# EAGLE design A4a ESP32-WROOM-32 (EAGLE 9.6.2)
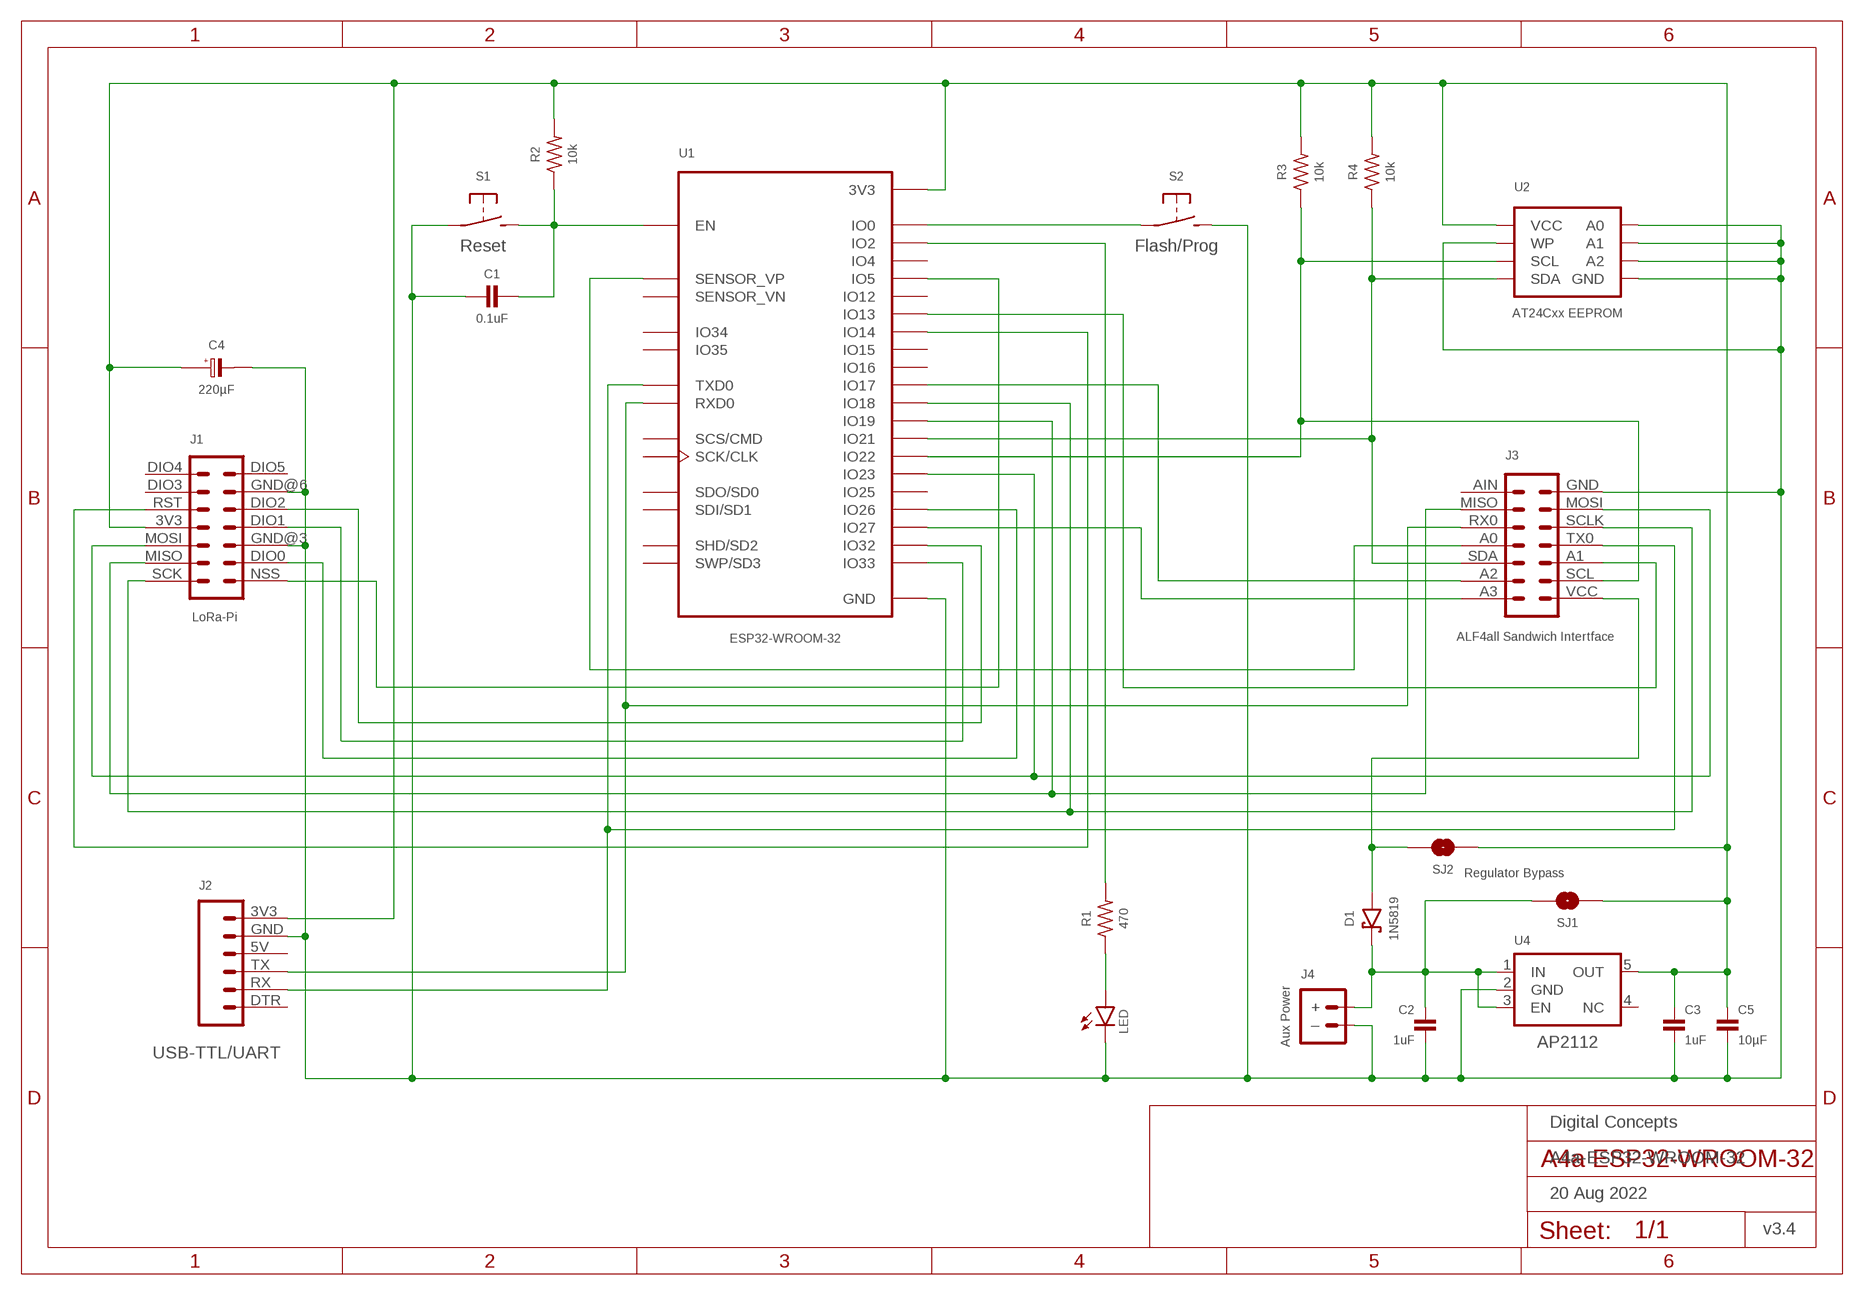
[diagram p0: schematic, sheet 1]
FRAME1 (A4L-LOC): DATE: 20 Aug 2022; OWNER: Digital Concepts; TITLE: A4a-ESP32-WROOM-32; VERSION: v3.4

## Parts
C1  0.1uF  CAPACITOR  [C0805@1]
C2  1uF  CAPACITOR-0805  [C0805]
C3  1uF  CAPACITOR-0805  [C0805]
C4  220µF  CAPACITOR-TANTALUM-3528  [C3528-21]
C5  10µF  CAPACITOR-0805  [C0805]
D1  1N5819  DIODE-SCHOTTKY-1N5819  [SOD-123]
J1  LoRa-Pi  RFM95W-PI-HEADER  [RFM95W-PI]
J2  USB-TTL/UART  HEADER-1X6-UART  [CONN_06-UART]
J3  ALF4all Sandwich Intertface  HEADER-2X7-ALF4ALL-PROCESSOR-B  [CONN_2X7-ALF4ALL-PROCESSOR-B]
J4  Aux Power  JST-PH2.0-2-MALE-HORIZONTALJST-PTH-2  [JST-PH2.0-2-HORIZONTAL]
LED  LEDCHIP-LED0805  [CHIP-LED0805]
R1  470  RESISTORR0805  [R0805]
R2  10k  RESISTORR0805  [R0805]
R3  10k  RESISTORR0805  [R0805]
R4  10k  RESISTORR0805  [R0805]
S1  Reset  SWITCH-MOMENTARY-2-PIN  [SWITCH-2-PAD]
S2  Flash/Prog  SWITCH-MOMENTARY-2-PIN  [SWITCH-2-PAD]
SJ1  Regulator Bypass  SJ  [SJ]
SJ2  SJ  [SJ]
U1  ESP32-WROOM-32  [ESP32-WROOM-32]
U2  AT24Cxx EEPROM  AT24CXX-EEPROM  [SOP-8]
U4  AP2112  REGULATOR-AP2112  [SOT25]

## Nets
GND: C1.2 C2.2 C3.2 C4.2(-) C5.2 J1.GND@3 J1.GND@6 J2.GND J3.GND J4.-(–) LED.C S1.P$1(P) S2.P$2(S) U1.GND@1(GND) U1.GND@15(GND) U1.GND@38(GND) U1.TP(GND) U1.TP@P1(GND) U1.TP@P2(GND) U1.TP@P3(GND) U1.TP@P4(GND) U1.TP@P5(GND) U1.TP@P6(GND) U1.TP@P7(GND) U1.TP@P8(GND) U1.TP@P9(GND) U1.TP@V1(GND) U1.TP@V2(GND) U1.TP@V3(GND) U1.TP@V4(GND) U1.TP@V5(GND) U1.TP@V6(GND) U1.TP@V7(GND) U1.TP@V8(GND) U1.TP@V9(GND) U1.TP@V10(GND) U1.TP@V11(GND) U1.TP@V12(GND) U1.TP@VP5(GND) U2.P$1(A0) U2.P$2(A1) U2.P$3(A2) U2.P$4(GND) U2.P$7(WP) U4.2(GND)
N$1: J1.DIO2 U1.IO32
N$2: J1.NSS U1.IO5
N$3: J1.SCK J3.SCLK U1.IO18
N$4: J1.RST U1.IO14
N$5: J1.MISO J3.MISO U1.IO19
N$6: J1.MOSI J3.MOSI U1.IO23
N$7: LED.A R1.1
N$8: S2.P$1(P) U1.IO0
N$9: J3.A2 U1.IO17
N$10: C2.1 D1.C J4.+ SJ1.1 U4.1(IN) U4.3(EN)
N$11: D1.A J3.VCC SJ2.1
N$12: J3.SCL R3.1 U1.IO22 U2.P$6(SCL)
N$13: C1.1 R2.1 S1.P$2(S) U1.EN
N$14: J3.SDA R4.1 U1.IO21 U2.P$5(SDA)
N$15: J3.A1 U1.IO13
N$16: J2.TX J3.RX0 U1.RXD0
N$17: R1.2 U1.IO2
N$18: J1.DIO0 U1.IO26
N$21: J3.A0 U1.SENSOR_VP
N$22: J3.A3 U1.IO27
N$26: J1.DIO1 U1.IO33
VC: J2.RX J3.TX0 U1.TXD0
VCC: C3.1 C4.1(+) C5.1 J1.3V3 J2.3V3 R2.2 R3.2 R4.2 SJ1.2 SJ2.2 U1.3V3 U2.P$8(VCC) U4.5(OUT)
Unconnected: J1.DIO3 J1.DIO4 J1.DIO5 J2.5V J2.DTR J3.AIN U1.CLK(SCK/CLK) U1.CMD(SCS/CMD) U1.IO4 U1.IO12 U1.IO15 U1.IO16 U1.IO25 U1.IO34 U1.IO35 U1.SD0(SDO/SD0) U1.SD1(SDI/SD1) U1.SD2(SHD/SD2) U1.SD3(SWP/SD3) U1.SENSOR_VN U4.4(NC)

## Library data of the parts
C1 = digitalconcepts:CAPACITOR: 0805 Capacitor
C2 C3 C5 = digitalconcepts:CAPACITOR-0805: 0805 Capacitor
C4 = digitalconcepts:CAPACITOR-TANTALUM-3528: Capacitor Polarised EIA 3528-21 (KEMET B)
D1 = digitalconcepts:DIODE-SCHOTTKY-1N5819: 1N5819 Schottky Diode SOD-123
J1 = digitalconcepts:RFM95W-PI-HEADER: RFM95W LoRa Wireless Transceiver Raspberry Pi Daughter Board
J2 = digitalconcepts:HEADER-1X6-UART: UART 6-Pin Header
J3 = digitalconcepts:HEADER-2X7-ALF4ALL-PROCESSOR-B: ALF4all 'Sandwich' Processor (Bottom) 2x7 Pin Header Header soldered to underside of PCB
J4 = digitalconcepts:JST-PH2.0-2-MALE-HORIZONTAL: PH2.0 2P Right Angle PCB Connector; PROD_ID: CONN-09863; SKU: PRT-09914
LED = digitalconcepts:LED: LED OSRAM: - CHIPLED LG R971, LG N971, LY N971, LG Q971, LY Q971, LO R971, LY R971 LH N974, LH R974 LS Q976, LO Q976, LY Q976 LO Q996 - Hyper CHIPLED LW Q18S LB Q993, LB Q99A, LB R99A - SideLED LS A670, LO A670, LY A670, LG A670, LP A670 LB A673, LV A673, LT A673, LW A673 LH A674 LY A675 LS A676, LA A676, LO A676, LY A676, LW A676 LS A679, LY A679, LG A679 - Hyper Micro SIDELED® LS Y876, LA Y876, LO Y876, LY Y876 LT Y87S - SmartLED LW L88C, LW L88S LB L89C, LB L89S, LG L890 LS L89K, LO L89K, LY L89K LS L896, LA L896, LO L896, LY L896 - TOPLED LS T670, LO T670, LY T670, LG T670, LP T670 LSG T670, LSP T670, LSY T670, LOP T670, LYG T670 LG T671, LOG T671, LSG T671 LB T673, LV T673, LT T673, LW T673 LH T674 LS T676, LA T676, LO T676, LY T676, LB T676, LH T676, LSB T676, LW T676 LB T67C, LV T67C, LT T67C, LS T67K, LO T67K, LY T67K, LW E67C LS E67B, LA E67B, LO E67B, LY E67B, LB E67C, LV E67C, LT E67C LW T67C LS T679, LY T679, LG T679 LS T770, LO T770, LY T770, LG T770, LP T770 LB T773, LV T773, LT T773, LW T773 LH T774 LS E675, LA E675, LY E675, LS T675 LS T776, LA T776, LO T776, LY T776, LB T776 LHGB T686 LT T68C, LB T68C - Hyper Mini TOPLED® LB M676 - Mini TOPLED Santana® LG M470 LS M47K, LO M47K, LY M47K Source: http://www.osram.convergy.de LUXEON: - LUMILED® LXK2-PW12-R00, LXK2-PW12-S00, LXK2-PW14-U00, LXK2-PW14-V00 LXK2-PM12-R00, LXK2-PM12-S00, LXK2-PM14-U00 LXK2-PE12-Q00, LXK2-PE12-R00, LXK2-PE12-S00, LXK2-PE14-T00, LXK2-PE14-U00 LXK2-PB12-K00, LXK2-PB12-L00, LXK2-PB12-M00, LXK2-PB14-N00, LXK2-PB14-P00, LXK2-PB14-Q00 LXK2-PR12-L00, LXK2-PR12-M00, LXK2-PR14-Q00, LXK2-PR14-R00 LXK2-PD12-Q00, LXK2-PD12-R00, LXK2-PD12-S00 LXK2-PH12-R00, LXK2-PH12-S00 LXK2-PL12-P00, LXK2-PL12-Q00, LXK2-PL12-R00 Source: www.luxeon.com KINGBRIGHT: KA-3528ASYC Source: www.kingbright.com
R1-R4 = digitalconcepts:RESISTOR: Resistor; SPICEPREFIX: R
S1 S2 = digitalconcepts:SWITCH-MOMENTARY-2-PIN: 2 Pin Momentary Switch
SJ1 SJ2 = digitalconcepts:SJ: Solder Jumper
U1 = digitalconcepts:ESP32-WROOM-32: ESP32-WROOM-32 MCU
U2 = digitalconcepts:AT24CXX-EEPROM: AT24Cxx EEPROM SOP-8
U4 = digitalconcepts:REGULATOR-AP2112: Diodes Incorporated LDO Regulator with Enable; OC_FARNELL: unknown; OC_NEWARK: unknown

## Board
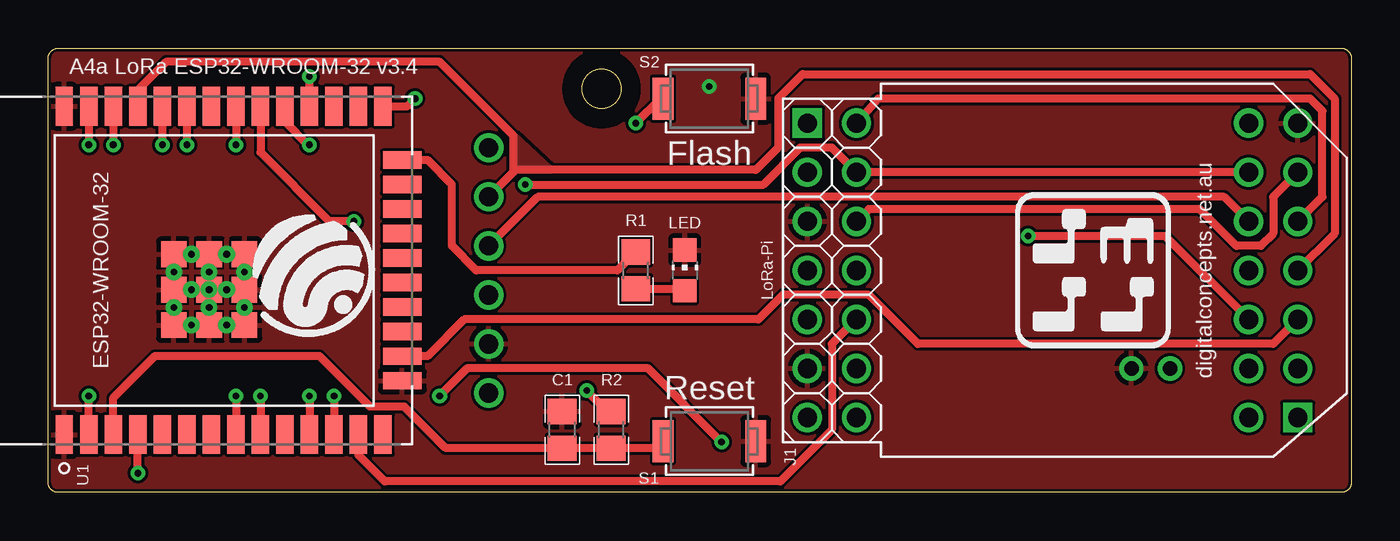
[diagram p1: board, top side]
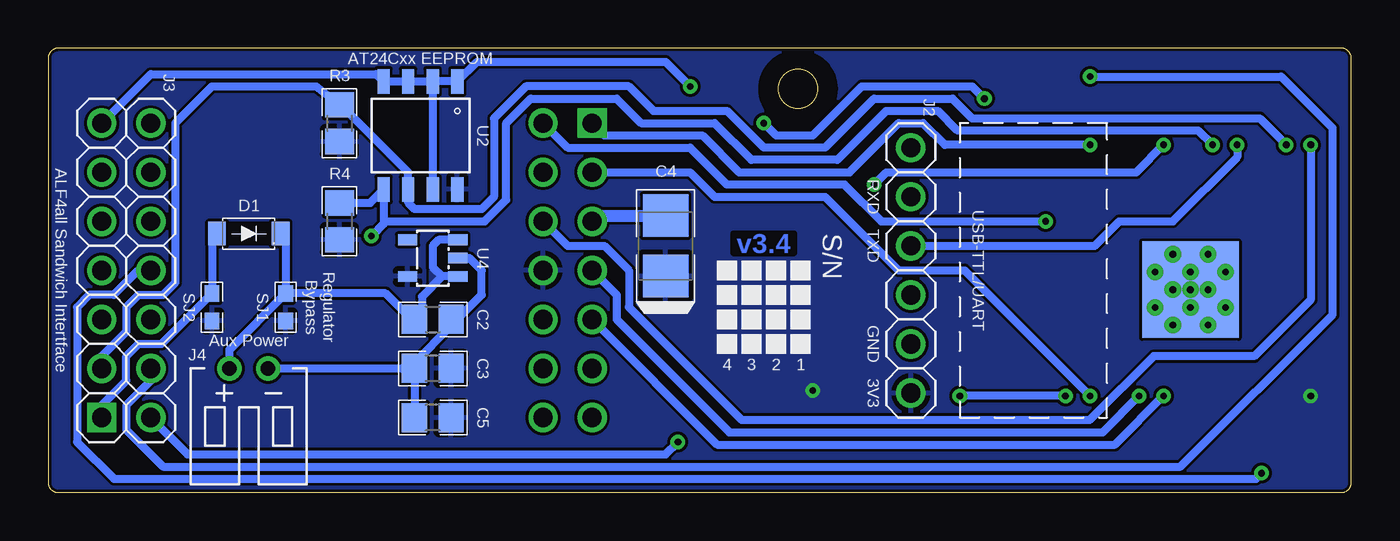
[diagram p2: board, bottom side, seen from below]

Size 67.49 x 23 mm. Coordinates in mm from the lower left corner, seen from the top.
Outline: 67.02,23 67.06,23 67.09,22.99 67.12,22.98 67.15,22.97 67.18,22.96 67.21,22.95 67.24,22.93 67.27,22.91 67.29,22.9 67.32,22.88 67.34,22.85 67.36,22.83 67.38,22.81 67.4,22.78 67.42,22.75 67.44,22.72 67.45,22.69 67.46,22.66 67.47,22.63 67.48,22.6 67.48,22.57 67.49,22.53 67.49,0.47 67.48,0.43 67.48,0.4 67.47,0.37 67.46,0.34 67.45,0.31 67.44,0.28 67.42,0.25 67.4,0.22 67.38,0.19 67.36,0.17 67.32,0.12 67.29,0.1 67.27,0.09 67.24,0.07 67.21,0.05 67.18,0.04 67.15,0.03 67.12,0.02 67.09,0.01 67.06,0 67.02,0 0.47,0 0.43,0 0.4,0.01 0.37,0.02 0.34,0.03 0.28,0.05 0.25,0.07 0.22,0.09 0.19,0.1 0.17,0.12 0.12,0.17 0.1,0.19 0.09,0.22 0.07,0.25 0.05,0.28 0.04,0.31 0.03,0.34 0.02,0.37 0.01,0.4 0,0.43 0,0.47 0,22.53 0,22.57 0.01,22.6 0.02,22.63 0.03,22.66 0.04,22.69 0.05,22.72 0.07,22.75 0.09,22.78 0.1,22.81 0.12,22.83 0.15,22.85 0.17,22.88 0.19,22.9 0.22,22.91 0.25,22.93 0.28,22.95 0.34,22.97 0.37,22.98 0.4,22.99 0.43,23 0.47,23 67.02,23
Outline: circle at 28.65,20.9 radius 1.02
Copper layers (1*16): Top 0.035mm / dielectric 1.5mm / Bottom 0.035mm
Design rules "default *": minimum track width 6mil, minimum drill 0.35mm, track to track 6mil, track to pad 6mil, pad to pad 6mil, via to via 6mil, smd to smd 6mil, copper to edge 6mil, drill to drill 6mil, minimum pad ring 10mil, minimum via ring 8mil, stop-mask expansion 4mil, vias tented up to drill 0mil, thermal gap 10mil

### Footprints (pad centres in the part's own frame; a part is rotated, then mirrored left to right if it is on the bottom)
C0805@1 = smd 1.3 x 1.5: 1 -0.95,0; 2 0.95,0
C0805 = smd 1.3 x 1.5: 1 -0.95,0; 2 0.95,0
C3528-21 = smd 2.21 x 2.35: 1 -1.565,0; 2 1.565,0
SOD-123 = smd 0.91 x 1.22: A -1.65,0; C 1.65,0
RFM95W-PI = drill 1 pad 1.524: 3V3 7.62,2.54; DIO0 2.54,0; DIO1 7.62,0; DIO2 10.16,0; DIO3 12.7,2.54; DIO4 15.24,2.54; DIO5 15.24,0; GND@3 5.08,0; GND@6 12.7,0; MISO 2.54,2.54; MOSI 5.08,2.54; RST 10.16,2.54; SCK 0,2.54 | drill 1 pad 1.524 square: NSS 0,0
CONN_06-UART = drill 1 pad 1.524: 3V3 12.7,0; 5V 7.62,0; DTR 0,0; GND 10.16,0; RX 2.54,0; TX 5.08,0
CONN_2X7-ALF4ALL-PROCESSOR-B = drill 1 pad 1.524: A0 7.62,2.54; A1 5.08,0; A2 2.54,2.54; A3 0,2.54; AIN 15.24,2.54; GND 15.24,0; MISO 12.7,2.54; MOSI 12.7,0; RX0 10.16,2.54; SCL 2.54,0; SCLK 10.16,0; SDA 5.08,2.54; TX0 7.62,0 | drill 1 pad 1.524 square: VCC 0,0
JST-PH2.0-2-HORIZONTAL = drill 0.75: + 1,0; - -1,0
CHIP-LED0805 = smd 1.2 x 1.2: A 0,-1.05; C 0,1.05
R0805 = smd 1.3 x 1.5: 1 -0.95,0; 2 0.95,0
SWITCH-2-PAD = smd 1.067 x 2.184: P$1 -2.4,0; P$2 2.4,0
SJ = smd 0.864 x 0.762: 1 -0.711,0; 2 0.711,0
ESP32-WROOM-32 = smd 2 x 0.9: 3V3 -8.5,6.74; EN -8.5,5.47; GND@1 -8.5,8.01; GND@38 8.5,8.01; IO0 8.5,-8.5; IO4 8.5,-7.23; IO5 8.5,-3.42; IO12 -8.5,-8.5; IO14 -8.5,-7.23; IO16 8.5,-5.96; IO17 8.5,-4.69; IO18 8.5,-2.15; IO19 8.5,-0.88; IO21 8.5,1.66; IO22 8.5,5.47; IO23 8.5,6.74; IO25 -8.5,-3.42; IO26 -8.5,-4.69; IO27 -8.5,-5.96; IO32 -8.5,-0.88; IO33 -8.5,-2.15; IO34 -8.5,1.66; IO35 -8.5,0.39; NC 8.5,0.39; RXD0 8.5,2.93; SENSOR_VN -8.5,2.93; SENSOR_VP -8.5,4.2; TXD0 8.5,4.2 | smd 0.9 x 2: CLK 0.635,-9.5; CMD -0.635,-9.5; GND@15 -5.715,-9.5; IO2 5.715,-9.5; IO13 -4.445,-9.5; IO15 4.445,-9.5; SD0 1.905,-9.5; SD1 3.175,-9.5; SD2 -3.175,-9.5; SD3 -1.905,-9.5 | smd 5 x 5 bottom: TP -1,0.51 | smd 1.33 x 1.33: TP@P1 -2.835,2.335; TP@P2 -1,2.335; TP@P3 0.835,2.335; TP@P4 -2.835,0.51; TP@P5 -1,0.51; TP@P6 0.835,0.51; TP@P7 -2.835,-1.325; TP@P8 -1,-1.325; TP@P9 0.835,-1.325 | drill 0.35 pad 0.406: TP@V1 -1.917,2.335; TP@V2 -0.083,2.335; TP@V3 -2.835,1.423; TP@V4 -1,1.423; TP@V5 0.835,1.423; TP@V6 -1.917,0.51; TP@V7 -0.083,0.51; TP@V8 -2.835,-0.403; TP@V9 -1,-0.403; TP@V10 0.835,-0.403; TP@V11 -1.917,-1.325; TP@V12 -0.083,-1.325; TP@VP5 -1,0.51
SOP-8 = smd 0.635 x 1.27: P$1 -1.905,-2.794; P$2 -0.635,-2.794; P$3 0.635,-2.794; P$4 1.905,-2.794; P$5 1.905,2.794; P$6 0.635,2.794; P$7 -0.635,2.794; P$8 -1.905,2.794
SOT25 = smd 0.55 x 1: 1 -0.95,-1.3; 2 0,-1.3; 3 0.95,-1.3; 4 0.95,1.3; 5 -0.95,1.3

### Placement (x,y rotation side)
C1  26.62,3.25 90 top
C2  47.57,8.96 0 bottom
C3  47.57,6.42 180 bottom
C4  35.51,12.77 90 bottom
C5  47.57,3.88 180 bottom
D1  57.1,13.41 0 bottom
J1  39.32,19.12 270 top
J2  22.81,17.85 270 bottom
J3  64.72,3.88 90 top
J4  57.1,6.42 180 bottom
LED  32.97,11.5 0 top
R1  30.43,11.5 90 top
R2  29.16,3.25 90 top
R3  52.4,19.12 270 bottom
R4  52.4,14.04 270 bottom
S1  34.24,2.66 180 top
S2  34.24,20.39 0 top
SJ1  55.19,9.6 270 bottom
SJ2  59,9.6 270 bottom
U1  8.84,11.5 90 top
U2  48.21,18.49 180 bottom
U4  47.57,12.14 90 bottom

### Tracks (layer width: path | path; a pad name or v marks a point on that pad's centre or on a via)
$X1
  cutout Top: 28.65,22.93 arc180 28.65,18.87 arc180
$X2
  cutout Bottom: 28.65,22.93 arc180 28.65,18.87 arc180
GND  (via drill 0.35)
  Bottom 0.406: U2.P$2 U2.P$3 U2.P$4 50.5,21.66 62.18,21.66 J3.GND | U2.P$2 U2.P$7 | J4.- C3.2 | U2.P$2 U2.P$1 45.29,22.3 35.51,22.3 v34.24,21.03 | 46.47,9.11 C2.2 | C3.2 48.52,6.73 46.62,8.63 C2.2 | C3.2 C5.2 | C2.2 46.3,8.96 45.03,10.23 45.03,11.5 45.67,12.14 U4.2
  Bottom 0.61: J1.GND@3 39.02,14.34 C4.2
  pour Top (rank 3): -1.32,24.2 68.53,24.2 68.53,-1.2 -1.32,-1.2
N$1  (via drill 0.35)
  Top 0.406: v9.72,5 U1.IO32
  Bottom 0.406: J1.DIO2 32.84,2.48 12.24,2.48 v9.72,5
N$2  (via drill 0.35)
  Top 0.406: U1.IO5 12.26,19.19 13.49,17.96 v13.53,18
  Bottom 0.406: J1.NSS 38.68,18.49 33.6,18.49 31.7,16.58 25.98,16.58 23.44,19.12 22.17,19.12 21.05,18 v13.53,18
N$3  (via drill 0.35)
  Top 0.406: J3.SCLK 65.99,15.31 65.99,19.76 65.35,20.39 42.98,20.39 J1.SCK | U1.IO18 10.99,17.61 14.55,14.04 v15.82,14.04
  Bottom 0.406: J1.SCK 40.59,17.85 34.24,17.85 32.33,15.95 26.24,15.95 24.33,14.04 v15.82,14.04
N$4
  Top 0.406: J1.RST 40.59,7.69 40.59,3.25 37.92,0.58 17.43,0.58 16.07,1.94 U1.IO14
N$5  (via drill 0.35)
  Top 0.406: J3.MISO J1.MISO 40.59,17.85 38.94,17.85 37.03,15.95 v24.71,15.95 | U1.IO19 v9.72,18
  Bottom 0.406: v9.72,18 11.14,16.58 24.08,16.58 v24.71,15.95
N$6  (via drill 0.35)
  Top 0.406: J3.MOSI 63.45,15.31 63.45,13.41 62.81,12.77 61.54,12.77 59.64,14.68 42.49,14.68 J1.MOSI | U1.IO23 v2.1,18
  Bottom 0.406: J1.MOSI 40.59,12.77 38.68,12.77 37.41,11.5 37.41,9.6 31.57,3.75 13.54,3.75 10.24,7.06 5.02,7.06 2.1,9.98 v2.1,18
N$7
  Top 0.406: R1.1 32.87,10.55 LED.A
N$8  (via drill 0.35)
  Top 0.406: U1.IO0 18.61,20 v19,20.39 | S2.P$1 31.7,20.39 v30.43,19.12
  Bottom 0.406: v19,20.39 19.63,21.03 25.35,21.03 27.89,18.49 29.79,18.49 v30.43,19.12
N$9  (via drill 0.35)
  Top 0.406: U1.IO17 v13.53,21.53
  Bottom 0.406: J3.A2 62.18,5.79 63.45,4.52 63.45,3.25 61.54,1.34 8.84,1.34 0.97,9.22 0.97,18.87 3.63,21.53 v13.53,21.53
N$10
  Bottom 0.406: SJ1.1 50.02,10.31 48.67,8.96 C2.1 48.13,9.35 48.13,10.15 47.09,11.19 | J4.+ 58.1,7.4 SJ1.1 | D1.C 55.19,13.15 SJ1.1 | U4.1 47.09,11.19 | U4.3 47.26,13.09 47.57,12.77 47.57,11.67 47.09,11.19
  pour Bottom: 47.57,11.67 47.57,10.7 47.09,11.19
N$11
  Bottom 0.406: J3.VCC 64.72,4.52 63.45,5.79 63.45,7.06 62.81,7.69 61.62,7.69 SJ2.1 59,13.15 D1.A
N$12  (via drill 0.35)
  Top 0.406: U1.IO22 v3.37,18
  Bottom 0.406: v3.37,18 4.74,19.38 19.63,19.38 20.65,20.39 24.71,20.39 27.25,17.85 30.43,17.85 32.33,19.76 36.14,19.76 37.41,21.03 42.75,21.03 44.4,19.38 44.4,15.31 45.03,14.68 48.51,14.68 48.84,15.01 U2.P$6 48.84,16.58 52.33,20.07 R3.1 53.61,21.03 59,21.03 60.91,19.12 60.91,10.87 61.54,10.23 62.81,10.23 63.45,9.6 63.45,8.33 64.72,7.06 J3.SCL
N$13
  Top 0.406: U1.EN 3.37,4.91 5.52,7.06 14.05,7.06 16.66,4.44 18.44,4.44 20.58,2.3 C1.1 R2.1 31.48,2.3 S1.P$2
N$14  (via drill 0.35)
  Top 0.406: U1.IO21 v7.18,18 | v50.75,13.28 57.86,13.28 J3.SDA
  Bottom 0.406: v7.18,18 7.92,18.74 20.4,18.74 21.41,19.76 24.08,19.76 26.62,17.22 31.06,17.22 32.97,19.12 36.78,19.12 38.05,20.39 42.49,20.39 43.76,19.12 43.76,15.16 44.88,14.04 49.99,14.04 v50.75,13.28 50.11,13.91 U2.P$5 50.82,14.99 R4.1
N$15
  Top 0.406: J3.A1 63.45,7.69 45.03,7.69 42.49,10.23 38.05,10.23 36.78,8.96 21.54,8.96 19.63,7.06 U1.IO13
N$16  (via drill 0.35)
  Top 0.406: J3.RX0 60.91,15.31 25.35,15.31 J2.TX | U1.RXD0 v5.91,18
  Bottom 0.406: v5.91,18 5.91,17.37 9.23,14.04 12.01,14.04 13.28,12.77 J2.TX
N$17
  Top 0.406: U1.IO2 19.63,17.22 20.9,15.95 20.9,12.77 22.17,11.5 29.48,11.5 R1.2
N$18  (via drill 0.35)
  Top 0.406: v13.53,5 U1.IO26
  Bottom 0.406: J1.DIO0 34.24,16.58 32.97,15.31 27.25,15.31 23.44,11.5 20.03,11.5 v13.53,5
N$21  (via drill 0.35)
  Top 0.406: v4.64,1 U1.SENSOR_VP
  Bottom 0.406: J3.A0 62.83,11.5 64.1,10.23 65.35,10.23 65.99,9.6 65.99,2.61 64.08,0.71 4.93,0.71 v4.64,1
N$22  (via drill 0.35)
  Top 0.406: v34.87,2.61 31.06,6.42 21.69,6.42 v20.27,5 | v14.8,5 U1.IO27
  Bottom 0.406: v34.87,2.61 35.51,1.98 60.27,1.98 J3.A3 | v14.8,5 v20.27,5
N$26  (via drill 0.35)
  Top 0.406: v10.99,5 U1.IO33
  Bottom 0.406: J1.DIO1 38.05,10.23 38.05,8.96 32.21,3.12 12.87,3.12 v10.99,5
VC
  Top 0.406: J3.TX0 66.62,13.41 66.62,20.39 65.35,21.66 39.07,21.66 37.8,20.39 37.8,17.85 36.65,16.71 24.08,16.71 | 24.08,16.71 24.08,18.49 20.27,22.3 6.1,22.3 4.64,20.84 U1.TXD0 | 24.08,16.71 24.08,16.58 J2.RX
  pour Top: 24.08,18.49 24.08,16.71 25.98,16.71
VCC  (via drill 0.35)
  Top 0.406: U1.3V3 v2.1,5 | v27.89,5.28 28.97,4.2 R2.2
  pour Bottom (rank 3): -0.69,23.57 67.89,23.57 67.89,-0.56 -0.69,-0.56

### Text on the board
Bottom: v3.4
tPlace: A4a LoRa ESP32-WROOM-32 v3.4 | digitalconcepts.net.au
bPlace: S/N | 1 | 2 | 3 | 4
bNames: RXD | TXD | Regulator / Bypass | GND | 3V3